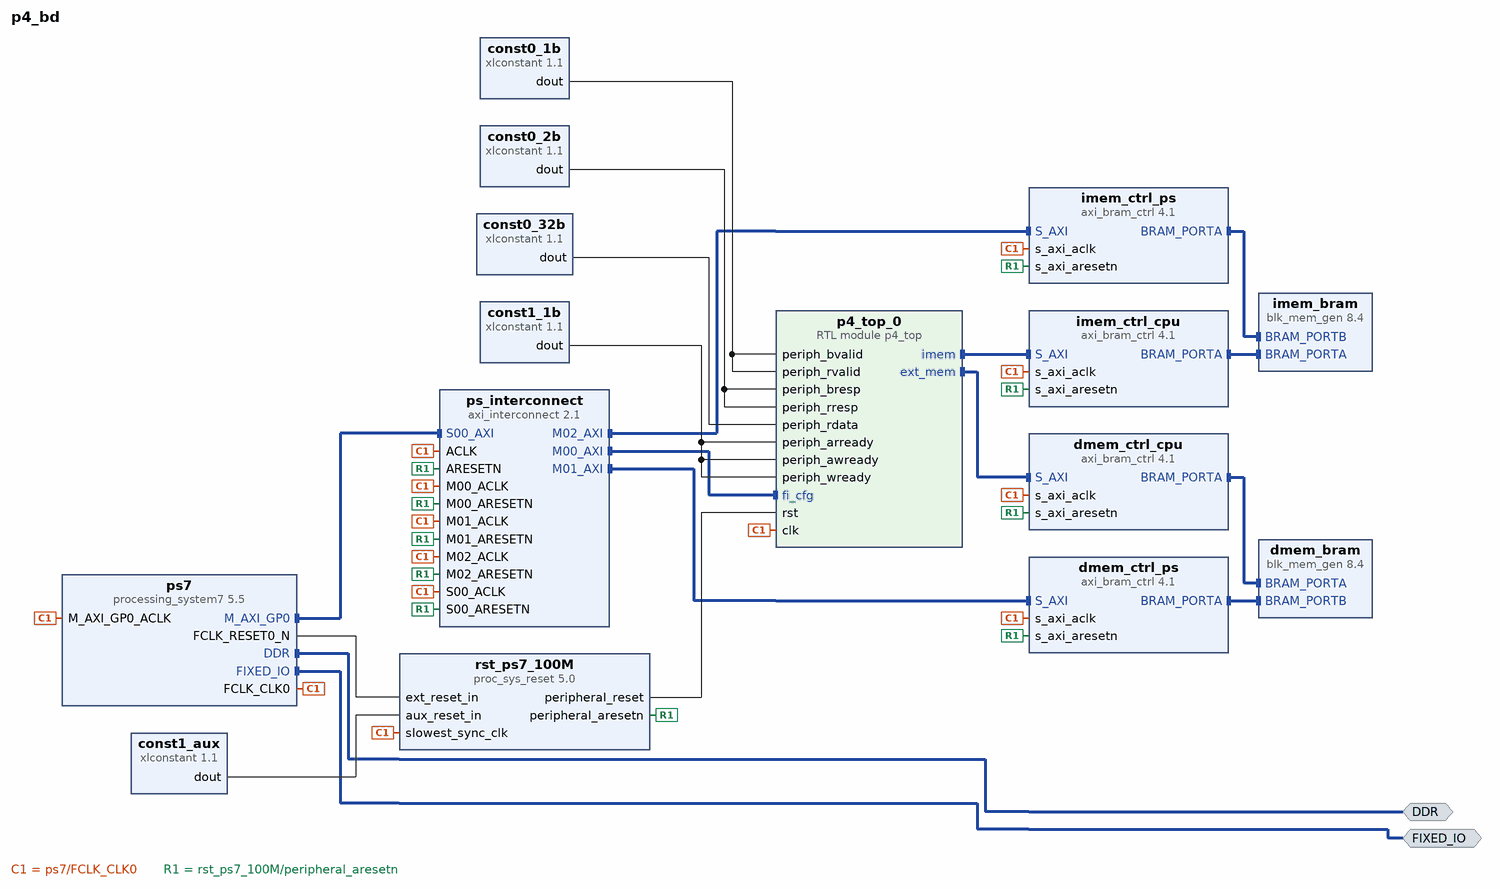
[diagram p0: block diagram of the top level]
# Vivado block design p4_bd, xc7z020clg484-1, Vivado 2025.1
create_bd_design p4_bd

create_bd_intf_port -mode Master -vlnv xilinx.com:interface:ddrx_rtl:1.0 DDR
create_bd_intf_port -mode Master -vlnv xilinx.com:display_processing_system7:fixedio_rtl:1.0 FIXED_IO

create_bd_cell -type ip -vlnv xilinx.com:ip:processing_system7:5.5 ps7
set_property -dict [list \
  CONFIG.PCW_APU_PERIPHERAL_FREQMHZ 666.666667 \
  CONFIG.PCW_ENET0_ENET0_IO {MIO 16 .. 27} \
  CONFIG.PCW_ENET0_GRP_MDIO_ENABLE 1 \
  CONFIG.PCW_ENET0_GRP_MDIO_IO {MIO 52 .. 53} \
  CONFIG.PCW_ENET0_PERIPHERAL_ENABLE 1 \
  CONFIG.PCW_ENET0_RESET_ENABLE 0 \
  CONFIG.PCW_ENET_RESET_ENABLE 1 \
  CONFIG.PCW_ENET_RESET_SELECT {Share reset pin} \
  CONFIG.PCW_FPGA0_PERIPHERAL_FREQMHZ 100 \
  CONFIG.PCW_FPGA1_PERIPHERAL_FREQMHZ 150.000000 \
  CONFIG.PCW_FPGA2_PERIPHERAL_FREQMHZ 50.000000 \
  CONFIG.PCW_GPIO_MIO_GPIO_ENABLE 1 \
  CONFIG.PCW_GPIO_MIO_GPIO_IO MIO \
  CONFIG.PCW_I2C_RESET_ENABLE 1 \
  CONFIG.PCW_PRESET_BANK1_VOLTAGE {LVCMOS 1.8V} \
  CONFIG.PCW_QSPI_GRP_SINGLE_SS_ENABLE 1 \
  CONFIG.PCW_QSPI_GRP_SINGLE_SS_IO {MIO 1 .. 6} \
  CONFIG.PCW_QSPI_PERIPHERAL_ENABLE 1 \
  CONFIG.PCW_QSPI_PERIPHERAL_FREQMHZ 200.000000 \
  CONFIG.PCW_QSPI_QSPI_IO {MIO 1 .. 6} \
  CONFIG.PCW_SD0_GRP_CD_ENABLE 1 \
  CONFIG.PCW_SD0_GRP_CD_IO {MIO 47} \
  CONFIG.PCW_SD0_GRP_WP_ENABLE 1 \
  CONFIG.PCW_SD0_GRP_WP_IO {MIO 46} \
  CONFIG.PCW_SD0_PERIPHERAL_ENABLE 1 \
  CONFIG.PCW_SD0_SD0_IO {MIO 40 .. 45} \
  CONFIG.PCW_SDIO_PERIPHERAL_FREQMHZ 50 \
  CONFIG.PCW_SINGLE_QSPI_DATA_MODE x4 \
  CONFIG.PCW_TTC0_PERIPHERAL_ENABLE 1 \
  CONFIG.PCW_TTC0_TTC0_IO EMIO \
  CONFIG.PCW_UART1_PERIPHERAL_ENABLE 1 \
  CONFIG.PCW_UART1_UART1_IO {MIO 48 .. 49} \
  CONFIG.PCW_UART_PERIPHERAL_FREQMHZ 50 \
  CONFIG.PCW_UIPARAM_DDR_FREQ_MHZ 533.333313 \
  CONFIG.PCW_UIPARAM_DDR_PARTNO {MT41J128M16 HA-15E} \
  CONFIG.PCW_USB0_PERIPHERAL_ENABLE 1 \
  CONFIG.PCW_USB0_RESET_ENABLE 0 \
  CONFIG.PCW_USB0_USB0_IO {MIO 28 .. 39} \
  CONFIG.PCW_USB_RESET_ENABLE 1 \
  CONFIG.PCW_USB_RESET_SELECT {Share reset pin} \
  CONFIG.preset ZedBoard \
] [get_bd_cells ps7]
# 222 more settings of ps7 are not shown: defaults, MIO pin electricals, DDR timing, and values the tool derives
create_bd_cell -type module -reference p4_top p4_top_0
create_bd_cell -type ip -vlnv xilinx.com:ip:axi_bram_ctrl:4.1 dmem_ctrl_cpu
set_property -dict {CONFIG.PROTOCOL AXI4LITE CONFIG.SINGLE_PORT_BRAM 1} [get_bd_cells dmem_ctrl_cpu]
create_bd_cell -type ip -vlnv xilinx.com:ip:axi_bram_ctrl:4.1 dmem_ctrl_ps
set_property -dict {CONFIG.PROTOCOL AXI4LITE CONFIG.SINGLE_PORT_BRAM 1} [get_bd_cells dmem_ctrl_ps]
create_bd_cell -type ip -vlnv xilinx.com:ip:blk_mem_gen:8.4 dmem_bram
set_property -dict [list \
  CONFIG.Enable_B Use_ENB_Pin \
  CONFIG.Memory_Type True_Dual_Port_RAM \
  CONFIG.Port_B_Clock 100 \
  CONFIG.Port_B_Enable_Rate 100 \
  CONFIG.Port_B_Write_Rate 50 \
  CONFIG.Use_RSTB_Pin true \
] [get_bd_cells dmem_bram]
create_bd_cell -type ip -vlnv xilinx.com:ip:axi_bram_ctrl:4.1 imem_ctrl_cpu
set_property -dict {CONFIG.PROTOCOL AXI4LITE CONFIG.SINGLE_PORT_BRAM 1} [get_bd_cells imem_ctrl_cpu]
create_bd_cell -type ip -vlnv xilinx.com:ip:axi_bram_ctrl:4.1 imem_ctrl_ps
set_property -dict {CONFIG.PROTOCOL AXI4LITE CONFIG.SINGLE_PORT_BRAM 1} [get_bd_cells imem_ctrl_ps]
create_bd_cell -type ip -vlnv xilinx.com:ip:blk_mem_gen:8.4 imem_bram
set_property -dict [list \
  CONFIG.Enable_B Use_ENB_Pin \
  CONFIG.Memory_Type True_Dual_Port_RAM \
  CONFIG.Port_B_Clock 100 \
  CONFIG.Port_B_Enable_Rate 100 \
  CONFIG.Port_B_Write_Rate 50 \
  CONFIG.Use_RSTB_Pin true \
] [get_bd_cells imem_bram]
create_bd_cell -type ip -vlnv xilinx.com:ip:axi_interconnect:2.1 ps_interconnect
set_property -dict {CONFIG.NUM_MI 3} [get_bd_cells ps_interconnect]
create_bd_cell -type ip -vlnv xilinx.com:ip:proc_sys_reset:5.0 rst_ps7_100M
create_bd_cell -type ip -vlnv xilinx.com:ip:xlconstant:1.1 const1_1b
set_property -dict {CONFIG.CONST_VAL 1 CONFIG.CONST_WIDTH 1} [get_bd_cells const1_1b]
create_bd_cell -type ip -vlnv xilinx.com:ip:xlconstant:1.1 const0_1b
set_property -dict {CONFIG.CONST_VAL 0 CONFIG.CONST_WIDTH 1} [get_bd_cells const0_1b]
create_bd_cell -type ip -vlnv xilinx.com:ip:xlconstant:1.1 const0_2b
set_property -dict {CONFIG.CONST_VAL 0 CONFIG.CONST_WIDTH 2} [get_bd_cells const0_2b]
create_bd_cell -type ip -vlnv xilinx.com:ip:xlconstant:1.1 const0_32b
set_property -dict {CONFIG.CONST_VAL 0 CONFIG.CONST_WIDTH 32} [get_bd_cells const0_32b]
create_bd_cell -type ip -vlnv xilinx.com:ip:xlconstant:1.1 const1_aux
set_property -dict {CONFIG.CONST_VAL 1 CONFIG.CONST_WIDTH 1} [get_bd_cells const1_aux]

# ---- connections ----

connect_bd_intf_net [get_bd_intf_pins dmem_ctrl_cpu/BRAM_PORTA] [get_bd_intf_pins dmem_bram/BRAM_PORTA]
connect_bd_intf_net [get_bd_intf_pins dmem_ctrl_ps/BRAM_PORTA] [get_bd_intf_pins dmem_bram/BRAM_PORTB]
connect_bd_intf_net [get_bd_intf_pins imem_ctrl_cpu/BRAM_PORTA] [get_bd_intf_pins imem_bram/BRAM_PORTA]
connect_bd_intf_net [get_bd_intf_pins imem_ctrl_ps/BRAM_PORTA] [get_bd_intf_pins imem_bram/BRAM_PORTB]
connect_bd_intf_net [get_bd_intf_pins p4_top_0/ext_mem] [get_bd_intf_pins dmem_ctrl_cpu/S_AXI]
connect_bd_intf_net [get_bd_intf_pins p4_top_0/imem] [get_bd_intf_pins imem_ctrl_cpu/S_AXI]
connect_bd_intf_net [get_bd_intf_ports DDR] [get_bd_intf_pins ps7/DDR]
connect_bd_intf_net [get_bd_intf_ports FIXED_IO] [get_bd_intf_pins ps7/FIXED_IO]
connect_bd_intf_net [get_bd_intf_pins ps7/M_AXI_GP0] [get_bd_intf_pins ps_interconnect/S00_AXI]
connect_bd_intf_net [get_bd_intf_pins ps_interconnect/M00_AXI] [get_bd_intf_pins p4_top_0/fi_cfg]
connect_bd_intf_net [get_bd_intf_pins ps_interconnect/M01_AXI] [get_bd_intf_pins dmem_ctrl_ps/S_AXI]
connect_bd_intf_net [get_bd_intf_pins ps_interconnect/M02_AXI] [get_bd_intf_pins imem_ctrl_ps/S_AXI]
connect_bd_net [get_bd_pins const0_1b/dout] [get_bd_pins p4_top_0/periph_bvalid] [get_bd_pins p4_top_0/periph_rvalid]
connect_bd_net [get_bd_pins const0_2b/dout] [get_bd_pins p4_top_0/periph_bresp] [get_bd_pins p4_top_0/periph_rresp]
connect_bd_net [get_bd_pins const0_32b/dout] [get_bd_pins p4_top_0/periph_rdata]
connect_bd_net [get_bd_pins const1_1b/dout] \
  [get_bd_pins p4_top_0/periph_awready] [get_bd_pins p4_top_0/periph_wready] [get_bd_pins p4_top_0/periph_arready]
connect_bd_net [get_bd_pins const1_aux/dout] [get_bd_pins rst_ps7_100M/aux_reset_in]
connect_bd_net [get_bd_pins ps7/FCLK_CLK0] \
  [get_bd_pins rst_ps7_100M/slowest_sync_clk] [get_bd_pins p4_top_0/clk] [get_bd_pins dmem_ctrl_cpu/s_axi_aclk] \
  [get_bd_pins dmem_ctrl_ps/s_axi_aclk] [get_bd_pins imem_ctrl_cpu/s_axi_aclk] [get_bd_pins imem_ctrl_ps/s_axi_aclk] \
  [get_bd_pins ps_interconnect/ACLK] [get_bd_pins ps_interconnect/S00_ACLK] [get_bd_pins ps_interconnect/M00_ACLK] \
  [get_bd_pins ps_interconnect/M01_ACLK] [get_bd_pins ps_interconnect/M02_ACLK] [get_bd_pins ps7/M_AXI_GP0_ACLK]
connect_bd_net [get_bd_pins ps7/FCLK_RESET0_N] [get_bd_pins rst_ps7_100M/ext_reset_in]
connect_bd_net [get_bd_pins rst_ps7_100M/peripheral_aresetn] \
  [get_bd_pins dmem_ctrl_cpu/s_axi_aresetn] [get_bd_pins dmem_ctrl_ps/s_axi_aresetn] \
  [get_bd_pins imem_ctrl_cpu/s_axi_aresetn] [get_bd_pins imem_ctrl_ps/s_axi_aresetn] [get_bd_pins ps_interconnect/ARESETN] \
  [get_bd_pins ps_interconnect/S00_ARESETN] [get_bd_pins ps_interconnect/M00_ARESETN] \
  [get_bd_pins ps_interconnect/M01_ARESETN] [get_bd_pins ps_interconnect/M02_ARESETN]
connect_bd_net [get_bd_pins rst_ps7_100M/peripheral_reset] [get_bd_pins p4_top_0/rst]
set_property HDL_ATTRIBUTE.BMM_INFO_PROCESSOR {arm > p4_bd dmem_ctrl_ps p4_bd imem_ctrl_ps} [get_bd_cells ps7]
set_property HDL_ATTRIBUTE.KEEP_HIERARCHY yes [get_bd_cells ps7]
set_property HDL_ATTRIBUTE.BMM_INFO_ADDRESS_SPACE {byte  0x40010000 32 > p4_bd dmem_bram} [get_bd_cells dmem_ctrl_ps]
set_property HDL_ATTRIBUTE.KEEP_HIERARCHY yes [get_bd_cells dmem_ctrl_ps]
set_property HDL_ATTRIBUTE.BMM_INFO_ADDRESS_SPACE {byte  0x40020000 32 > p4_bd imem_bram} [get_bd_cells imem_ctrl_ps]
set_property HDL_ATTRIBUTE.KEEP_HIERARCHY yes [get_bd_cells imem_ctrl_ps]

# ---- address map ----
assign_bd_address -offset 0x00000000 -range 16K -target_address_space [get_bd_addr_spaces p4_top_0/ext_mem] [get_bd_addr_segs dmem_ctrl_cpu/S_AXI/Mem0]
assign_bd_address -offset 0x00030000 -range 4K -target_address_space [get_bd_addr_spaces p4_top_0/imem] [get_bd_addr_segs imem_ctrl_cpu/S_AXI/Mem0]
assign_bd_address -offset 0x40000000 -range 4K -target_address_space [get_bd_addr_spaces ps7/Data] [get_bd_addr_segs p4_top_0/fi_cfg/reg0]
assign_bd_address -offset 0x40010000 -range 16K -target_address_space [get_bd_addr_spaces ps7/Data] [get_bd_addr_segs dmem_ctrl_ps/S_AXI/Mem0]
assign_bd_address -offset 0x40020000 -range 4K -target_address_space [get_bd_addr_spaces ps7/Data] [get_bd_addr_segs imem_ctrl_ps/S_AXI/Mem0]

validate_bd_design
save_bd_design
